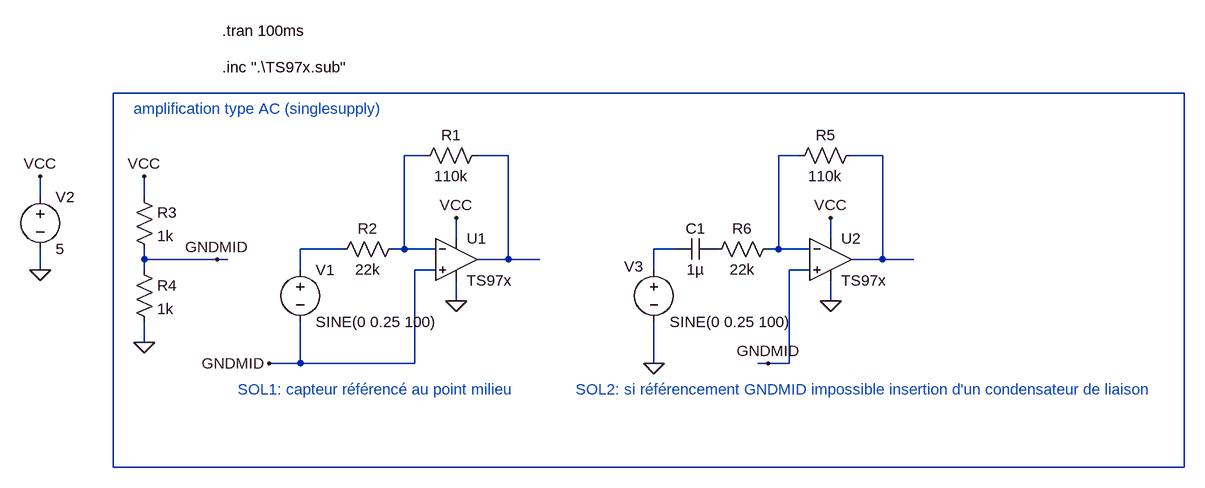
[diagram p0: schematic AOPMonoTension.asc]
AOPMonoTension.asc, the LTspice schematic file:
Version 4
SHEET 1 1788 680
WIRE 1648 0 0 0
WIRE 480 96 448 96
WIRE 608 96 560 96
WIRE 1056 96 1024 96
WIRE 1184 96 1136 96
WIRE -112 160 -112 128
WIRE 48 160 48 128
WIRE 528 224 528 192
WIRE 1104 224 1104 192
WIRE 352 240 288 240
WIRE 448 240 448 96
WIRE 448 240 432 240
WIRE 496 240 448 240
WIRE 864 240 832 240
WIRE 1024 240 1024 96
WIRE 1024 240 1008 240
WIRE 1072 240 1024 240
WIRE 48 256 48 240
WIRE 160 256 48 256
WIRE 176 256 160 256
WIRE 608 256 608 96
WIRE 608 256 560 256
WIRE 656 256 608 256
WIRE 1184 256 1184 96
WIRE 1184 256 1136 256
WIRE 1232 256 1184 256
WIRE -112 272 -112 240
WIRE 48 272 48 256
WIRE 288 272 288 240
WIRE 496 272 464 272
WIRE 832 272 832 240
WIRE 1072 272 1040 272
WIRE 528 320 528 288
WIRE 1104 320 1104 288
WIRE 48 384 48 352
WIRE 288 416 288 352
WIRE 288 416 240 416
WIRE 464 416 464 272
WIRE 464 416 288 416
WIRE 832 416 832 352
WIRE 1008 416 992 416
WIRE 1040 416 1040 272
WIRE 1040 416 1008 416
WIRE 0 576 0 0
WIRE 1648 576 1648 0
WIRE 1648 576 0 576
FLAG 528 192 VCC
FLAG -112 272 0
FLAG -112 128 VCC
FLAG 48 384 0
FLAG 48 128 VCC
FLAG 240 416 GNDMID
FLAG 160 256 GNDMID
FLAG 528 320 0
FLAG 1104 192 VCC
FLAG 1008 416 GNDMID
FLAG 1104 320 0
FLAG 832 416 0
SYMBOL Opamps\\opamp2 528 192 R0
SYMATTR InstName U1
SYMATTR Value TS97x
SYMBOL res 576 80 R90
WINDOW 0 0 56 VBottom 2
WINDOW 3 32 56 VTop 2
SYMATTR InstName R1
SYMATTR Value 110k
SYMBOL res 448 224 R90
WINDOW 0 0 56 VBottom 2
WINDOW 3 32 56 VTop 2
SYMATTR InstName R2
SYMATTR Value 22k
SYMBOL voltage 288 256 R0
WINDOW 123 0 0 Left 2
WINDOW 39 0 0 Left 2
SYMATTR InstName V1
SYMATTR Value SINE(0 0.25 100)
SYMBOL voltage -112 144 R0
WINDOW 123 0 0 Left 2
WINDOW 39 0 0 Left 2
SYMATTR InstName V2
SYMATTR Value 5
SYMBOL res 32 144 R0
SYMATTR InstName R3
SYMATTR Value 1k
SYMBOL res 32 256 R0
SYMATTR InstName R4
SYMATTR Value 1k
SYMBOL Opamps\\opamp2 1104 192 R0
SYMATTR InstName U2
SYMATTR Value TS97x
SYMBOL res 1152 80 R90
WINDOW 0 0 56 VBottom 2
WINDOW 3 32 56 VTop 2
SYMATTR InstName R5
SYMATTR Value 110k
SYMBOL res 1024 224 R90
WINDOW 0 0 56 VBottom 2
WINDOW 3 32 56 VTop 2
SYMATTR InstName R6
SYMATTR Value 22k
SYMBOL voltage 832 256 R0
WINDOW 123 0 0 Left 2
WINDOW 39 0 0 Left 2
WINDOW 0 -46 11 Left 2
SYMATTR InstName V3
SYMATTR Value SINE(0 0.25 100)
SYMBOL cap 928 224 R90
WINDOW 0 0 32 VBottom 2
WINDOW 3 32 32 VTop 2
SYMATTR InstName C1
SYMATTR Value 1µ
TEXT 168 -40 Left 2 !.inc ".\\TS97x.sub"
TEXT 168 -96 Left 2 !.tran 100ms
TEXT 32 24 Left 2 ;amplification type AC (singlesupply)
TEXT 192 456 Left 2 ;SOL1: capteur référencé au point milieu
TEXT 712 456 Left 2 ;SOL2: si référencement GNDMID impossible insertion d'un condensateur de liaison

The netlist it stands for:
* AOPMonoTension.asc
XU1 GNDMID N002 VCC 0 N003 TS97x  ; pins In+ In- V+ V- OUT
R1 N003 N002 110k
R2 N002 N006 22k
V1 N006 GNDMID SINE(0 0.25 100)
V2 VCC 0 5
R3 VCC GNDMID 1k
R4 GNDMID 0 1k
XU2 GNDMID N004 VCC 0 N005 TS97x  ; pins In+ In- V+ V- OUT
R5 N005 N004 110k
R6 N004 P001 22k
V3 N007 0 SINE(0 0.25 100)
C1 P001 N007 1µ
.inc ".\TS97x.sub"
.tran 100ms
* amplification type AC (singlesupply)
* SOL1: capteur référencé au point milieu
* SOL2: si référencement GNDMID impossible insertion d'un condensateur de liaison
.backanno
.end